# Altium schematic sheet Sheet1.SchDoc
size A4; SheetNumber: 1; SheetTotal: 1
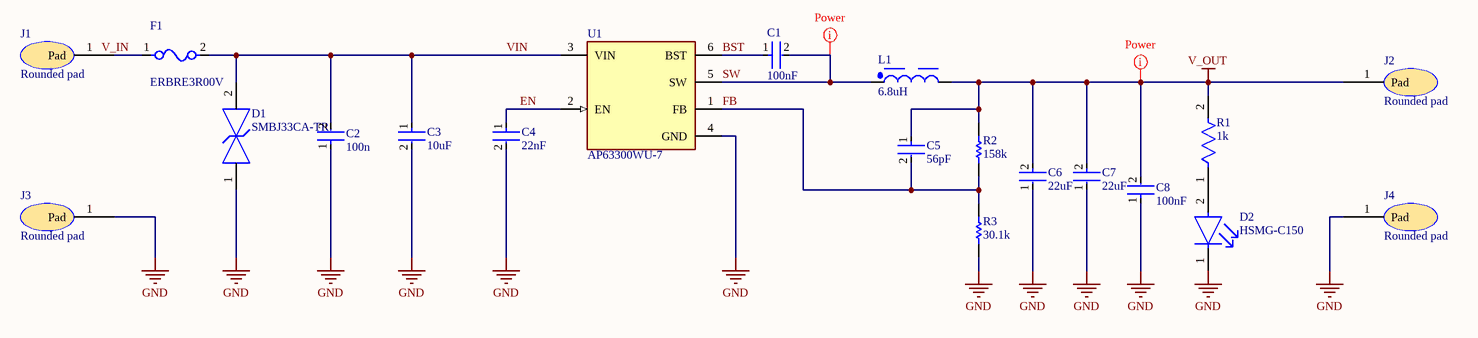
[diagram p0: Sheet1.SchDoc]

## Parts
C1  100nF  [FP-CGA3E-0_3-0_1-IPC_A]
C2  100n  [FP-CGA3E-0_3-0_1-IPC_A]
C3  10uF  [FP-2220-L_5_7_0_5-W_5_0_4-IPC_A]
C4  22nF  [FP-CC0603-DA-MFG]
C5  56pF  [FP-C0603C-CF-MFG]
C6  22uF  [FP-GCM32E-0_35-e0_3_1_275-MFG]
C7  22uF  [FP-GCM32E-0_35-e0_3_1_275-MFG]
C8  100nF  [FP-CGA3E-0_3-0_1-IPC_A]
D1  SMBJ33CA-TR  [FP-SMB-CA-MFG]
D2  HSMG-C150  [FP-HSMG-C150-MFG]
F1  ERBRE3R00V  [FP-ERBRE-MFG]
J1  Rounded pad  [PCBComponent_1]
J2  Rounded pad  [PCBComponent_1]
J3  Rounded pad  [PCBComponent_1]
J4  Rounded pad  [PCBComponent_1]
L1  6.8uH  [WE-LHMI_8030]
R1  1k  [FP-AC0603-IPC_B]
R2  158k  [RESC1609X50X30LL10T20]
R3  30.1k  [RESC1608X55X30NL15T15]
U1  AP63300WU-7  [FP-TSOT26-IPC_A]

## Nets
GND: C2.1 C3.2 C4.2 C6.1 C7.1 C8.1 D1.1 D2.1(C) J3.1(Pad) J4.1(Pad) R3.1 U1.4(GND)
V_OUT: C5.1 C6.2 C7.2 C8.2 J2.1(Pad) L1.2 R1.2 R2.2
BST: C1.1 U1.6(BST)
EN: C4.1 U1.2(EN)
FB: C5.2 R2.1 R3.2 U1.1(FB)
SW: C1.2 L1.1 U1.5(SW)
VIN: C2.2 C3.1 D1.2 F1.2 U1.3(VIN)
NetD2_2: D2.2(A) R1.1
NetF1_1: F1.1 J1.1(Pad)

## Layout directives
mark named Power: SW, V_OUT

## Notes on the sheet
- Labels drawn without touching a wire or pin: V_IN

## Library data of the parts
C1 C2 C8 = CMP-2000-07546-2: Cap Ceramic 100nF 50V X7R 10% Pad SMD 0603 +125°C Automotive T/R; Weight: 7.1E-05oz; Composition: Ceramic; Max Operating Temperature: 125°C; Termination: SMD/SMT; Dielectric: X7R; Length: 1.6mm; Package Quantity: 1; REACH SVHC: No SVHC; Lead Free: Lead Free; Case Code (Metric): 1608; Min Operating Temperature: -55°C; Packaging: Tape and Reel; Tolerance: 10%; Voltage Rating: 50V; Case Code (Imperial): 0603; Capacitance: 100nF; Case/Package: 0603; Voltage Rating (DC): 50V; Depth: 0.8mm; Radiation Hardening: No; Ratings: AEC-Q200; Mount: Surface Mount; Voltage: 50V; Thickness: 0.035inch; Width: 0.8mm; Height: 0.8mm
C3 = CMP-04427-001477-1: General Purpose Ceramic Capacitor, 2220, 10uF, 10%, X7R, 15%, 50V; Dissipation Factor: 2.5%; Tolerance: 10%; Depth: 5mm; Thickness: 0.11inch; Construction: Flat; REACH SVHC: No SVHC; Length: 5.7mm; Voltage Rating (DC): 50V; Contact Plating: Tin; Capacitance: 10uF; Radiation Hardening: No; Packaging: Tape and Reel; Height: 2.79mm; Width: 0.197inch; Dielectric: X7R; Case Code (Imperial): 2220; Package Quantity: 500; Max Operating Temperature: 125°C; Case/Package: 2220; Voltage: 50V; Voltage Rating: 50V; Number of Pins: 2; Case Code (Metric): 5750; Lead Free: Lead Free; Series: Standard; Termination: SMD/SMT; RoHS Compliant: Yes; Mount: Surface Mount; Min Operating Temperature: -55°C
C4 = CMP-2100-03602-3: CAP CER 0.022UF 50V X7R 0603; Dielectric Material: Ceramic; Insulation Resistance: 100GR; Tolerance: 10%; Thickness: 0.035inch; Case/Package: 0603; Packaging: Tape and Reel; Voltage Rating (DC): 50V; Length: 1.6mm; Depth: 0.8mm; Dielectric: X7R; Resistor Type: Ceramic; Min Operating Temperature: -55°C; Number of Pins: 2; Series: CC; Mount: Surface Mount; Max Operating Temperature: 125°C; Capacitance: 22nF; Case Code (Imperial): 0603; Width: 0.031inch; Halogen Free: Halogen Free; Lead Free: Lead Free; Voltage: 50V; RoHS Compliant: Yes; Package Quantity: 1; Height: 0.8mm; REACH SVHC: No SVHC; Voltage Rating: 50V; Case Code (Metric): 1608; Termination: SMD/SMT; Radiation Hardening: No
C5 = CMP-2006-03385-2: CAP CER 56PF 50V 1% NP0 0603; Manufacturer: KEMET; Manufacturer Part Number: C0603C560F5GACTU; Material: Ceramic; Tolerance: 0.01; Temperature Coefficient: 30ppm/°C; Automotive Grade: Grade 1; Temperature Characteristic: C0G; Capacitance: 56 pF; ComponentLink2Description: Datasheet; Package: C0603C-CF; Lead Free: Yes; Digikey Description: CAP CER 56PF 50V 1% NP0 0603; Mouser Description: Multilayer Ceramic Capacitors MLCC - SMD/SMT 50volts 56pF C0G 1%; Value: 56 pF; Temperature Range High: +125°C; Category: Cap; Temperature Range Low: -55°C; RoHS: TRUE; ComponentLink2URL: https://api.kemet.com/component-edge/download/datasheet/C0603C100J5GACAUTO.pdf; Device Class L1: Passive Components; Device Class L2: Capacitors; Temperature: -55°C to +125°C; Device Class L3: Ceramic Capacitors; Height: 0.87mm; Octopart: https://octopart.com/c0603c560f5gactu-kemet-9143760; Automotive: Yes; Voltage Rating: 50 V
C6 C7 = CMP-06035-055667-1: Ceramic Capacitor for Automotive 22uF ±10% 25VDC X8L 1210 Embossed T/R
D1 = CMP-12225-000040-1: TVS DIODE 33V 69.7V SMB; Manufacturer: STMicroelectronics; Direction: Bidirectional; Peak Pulse Current: 11.8A; Peak Pulse Power: 600W; Clamping Voltage: 53.3V; Breakdown Voltage: 36.7V; Number Of Channels: 1; Standoff Height: 0.05mm; Max Junction Temp: +150°C; Lead Free: Yes; Device Class L1: Circuit Protection; Device Class L3: unset; Mouser Description: TVS Diodes - Transient Voltage Suppressors 600W 33V Bidirect; Device Class L2: TVS Diodes; Temperature Range High: +150°C; Temperature: -55°C to +150°C; Temperature Range Low: -55°C; Octopart: https://octopart.com/smbj33ca-tr-stmicroelectronics-347069; Manufacturer Part Number: SMBJ33CA-TR; Automotive: No; ComponentLink2URL: https://www.st.com/resource/en/datasheet/smbj.pdf; RoHS: TRUE; Package: SMB-CA; Category: Diode; ComponentLink2Description: Datasheet; Height: 2.65mm; Reverse Standoff Voltage: 33V; Digikey Description: TVS DIODE 33V 69.7V SMB
D2 = CMP-2000-05061-2: LED GREEN DIFFUSED 1206 SMD; Manufacturer: Broadcom; Led Orientation: Top View; Max Junction Temp: +95°C; Peak Emmision Wavelength: 570nm; Viewing Angle: 170°; Wavelength: 572nm; Reverse Voltage: 5V; Luminous Intensity: 15mcd; Forward Voltage: 2.2V; Power Dissipation: 65mW; Forward Current: 20mA; ComponentLink2Description: Datasheet; Lead Free: Yes; Temperature Range Low: -40°C; Package: HSMG-C150; Digikey Description: LED GREEN DIFFUSED 1206 SMD; Mouser Description: LED Uni-Color Green 570nm 2-Pin Chip LED T/R; Manufacturer Part Number: HSMG-C150; Temperature Range High: +85°C; Device Class L1: Optoelectronics; Colour: Green; Category: Diode; Device Class L3: unset; RoHS: TRUE; Height: 1.2mm; ComponentLink2URL: https://docs.broadcom.com/docs/AV02-0551EN; Device Class L2: LEDs; Automotive: No; Ipc Land Pattern Name: DIOCP320160X55; Octopart: https://octopart.com/hsmg-c150-broadcom-71131304; Temperature: -40°C to +85°C
F1 = CMP-00287-20105398-1: ERBRE3R00V Fuse Chip Fast Acting 3A 32V SMD Solder Pad 0603 1.6 X 0.8 X 0.54mm T/R UL/cUL; Body Material: Alumina; Approvals: UL; Resistance: 33mΩ; Max Operating Temperature: 125°C; REACH SVHC: No SVHC; Case/Package: 0603; Depth: 800µm; Case Code (Metric): 1608; Number of Pins: 2; Height: 640µm; Width: 800µm; Max Voltage Rating (DC): 32V; Case Code (Imperial): 0603; Voltage Rating: 32V; Min Operating Temperature: -40°C; RoHS: Compliant; Fuse Current: 3A; Lifecycle Status: Production; Packaging: Cut Tape; Current: 3A; Mount: Surface Mount; Length: 1.6mm; Current Rating: 3A; Voltage Rating (DC): 32V
L1 = CMP-03913-61645301-4: 74437356068 Power Inductor, 6.8Uh, Shielded, 5.1A Rohs Compliant: Yes; Self Resonant Frequency: 14MHz; Test Frequency: 100kHz; DC Resistance (DCR): 35.5mΩ; Saturation Current: 6.9A; Tolerance: 20%; Inductance: 6.8µH; Core Material: Ferrite; Current Rating: 5.1A; Composition: Wirewound; Min Operating Temperature: -40°C; Shielding: Shielded; NexarPartId: 61645301; Case/Package: Nonstandard; Packaging: Tape & Reel (TR); Ambient Temperature Range Low: -40°C; Max Operating Temperature: 125°C; Length: 9.7mm; RoHS: Compliant; Ambient Temperature Range High: 85°C; Width: 8.5mm; Mount: Surface Mount; Height: 3mm; Height - Seated (Max): 2.9972mm
R1 = CMP-2000-04828-3: RES 1kΩ 1.00% 0.1W 0603; Voltage Rating: 50V; Power Rating: 100mW; Tolerance: 1%; Temperature Coefficient: 100ppm/°C; Resistance: 1kR; Depth: 0.8mm; Case/Package: 0603; Size Code: 0603; Case Code (Metric): 1608; Height: 0.022inch; Series: AC; Width: 0.031inch; Construction: Rectangular; Length: 0.063inch; Case Code (Imperial): 0603; Package Quantity: 1; RoHS Compliant: Yes; Features: Moisture Resistant; Resistor Type: Thick Film; Max Power Dissipation: 100mW; Packaging: Tape and Reel; Termination: SMD/SMT; Ratings: AEC-Q200; Max Operating Temperature: 155°C; Min Operating Temperature: -55°C; Military Standard: Not; Lead Free: Lead Free; Number of Terminations: 2
R2 = CMP-2000-03225-1: Manufacturer: Vishay Dale; Part Number: CRCW060330K1FKEA
R3 = CMP-1012-00756-2: Manufacturer: Panasonic; Part Number: ERJ-3EKF1583V
U1 = CMP-12757-000025-1: DCDC CONV HV BUCK TSOT26